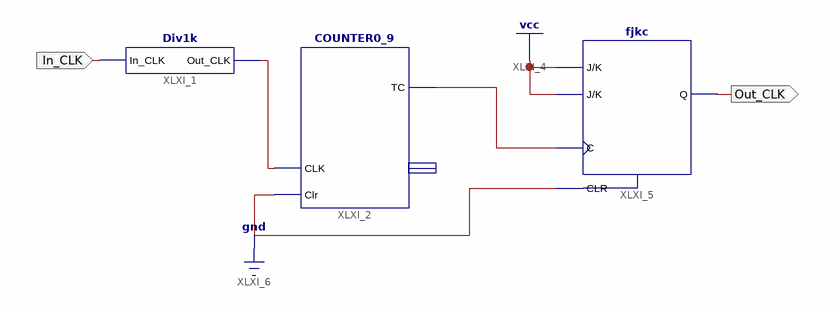
[diagram p0: schematic sheet 1]
// Xilinx ISE schematic Div20K.sch (spartan6) as structural Verilog: 3 symbols, 2 ports
module Div20K (
  input  In_CLK,
  output Out_CLK
);

  wire XLXN_8, XLXN_11;

  Div1k XLXI_1 (.In_CLK(In_CLK), .Out_CLK(XLXN_8));
  COUNTER0_9 XLXI_2 (.CLK(XLXN_8), .Clr(1'b0), .TC(XLXN_11));  // open: bit
  fjkc XLXI_5 (.C(XLXN_11), .CLR(1'b0), .J(1'b1), .K(1'b1), .Q(Out_CLK));
endmodule
